# Altium project Sandbox.PrjPcb
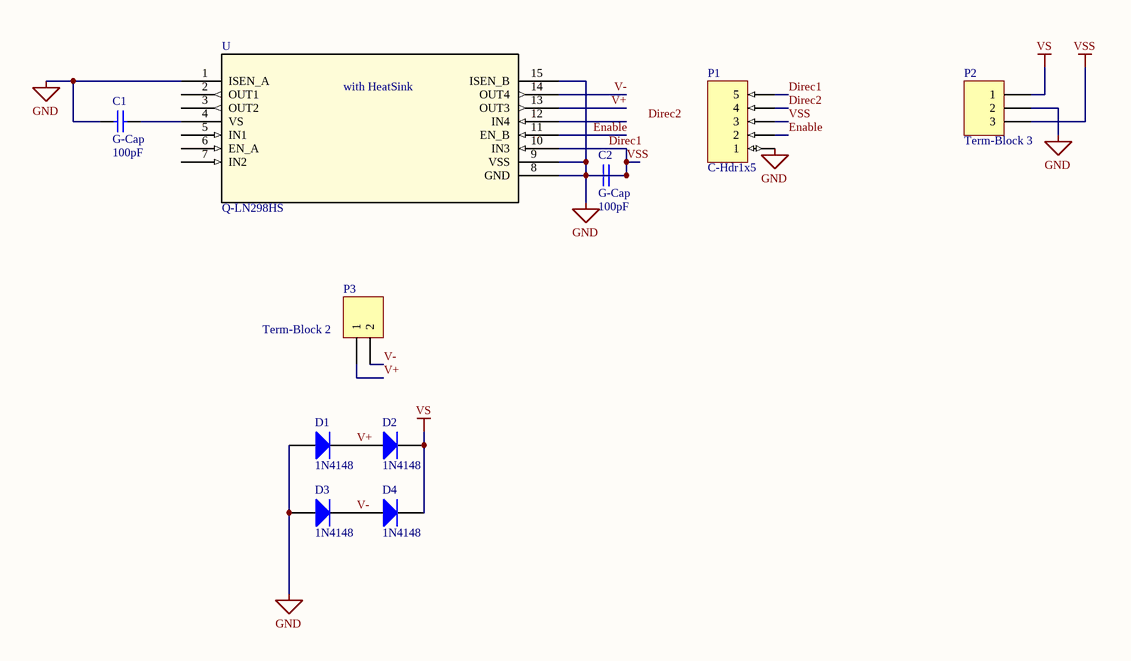
[diagram p0: Sheet1.SchDoc]
1 sheet, 10 parts. Net scope: global (net labels, ports and power ports of the same name join across sheets).
Board file: PCB1.PcbDoc

## Sheet Sheet1.SchDoc
size A4

### Parts
C1  G-Cap  value 100pF  [Cap2.54mm_LGE1.0]
C2  G-Cap  value 100pF  [Cap2.54mm_LGE1.0]
D1  1N4148  [DO-41_XLGE1.2]
D2  1N4148  [DO-41_XLGE1.2]
D3  1N4148  [DO-41_XLGE1.2]
D4  1N4148  [DO-41_XLGE1.2]
P1  C-Hdr1x5  [HDR1X5_LGE1.0]
P2  Term-Block 3  [TERM-BLOCK-5.08MM-3POS]
P3  Term-Block 2  [TERM-BLOCK-5.08MM-2POS]
U  Q-LN298HS  [Multiwatt15_V_ELEC391HS]

### Nets
Direc1: C1.1 C2.1 C2.2 D1.1(A) D3.1(A) P1.1 P1.3 P1.5 P2.2 P2.3 U.1(ISEN_A) U.8(GND) U.9(VSS) U.10(IN3) U.15(ISEN_B)  [also labelled GND, VSS]
VS: D2.2(K) D4.2(K) P2.1
Direc2: P1.4
Enable: P1.2 U.11(EN_B)
V+: D1.2(K) D2.1(A) P3.1 U.13(OUT3)
V-: D3.2(K) D4.1(A) P3.2 U.14(OUT4)
NetC1_2: C1.2 U.4(VS)

Not connected (* = marked no-connect by the designer): U 2(OUT1) 3(OUT2) 5(IN1) 6(EN_A) 7(IN2) 12(IN4)

### Notes on the sheet
- Labels drawn without touching a wire or pin: Direc2
- (in symbol Q-LN298HS) with HeatSink

### Library data of the parts
C1 C2 = G-Cap: Capacitor (specify value); Published: 8-Jun-2000; LatestRevisionDate: 17-Jul-2002; LatestRevisionNote: Re-released for DXP Platform.; PackageReference: RAD-0.3; Publisher: Altium Limited
D1-D4 = T-DiodeRect: High-speed Diode; ComponentLink1URL: http://www.mccsemi.com/up_pdf/1N4148(DO-35).pdf; ComponentLink1Description: Datasheet (ELEC391)
P1 = C-Hdr1x5: Header, 6-Pin; LatestRevisionDate: 17-Jul-2002; LatestRevisionNote: Re-released for DXP Platform.; Publisher: Altium Limited
P2 = C-Block3: Terminal-Block 1x3; LatestRevisionDate: 17-Jul-2002; LatestRevisionNote: Re-released for DXP Platform.; Publisher: Altium Limited
P3 = C-Block2: Terminal-Block 1x2; LatestRevisionDate: 17-Jul-2002; LatestRevisionNote: Re-released for DXP Platform.; Publisher: Altium Limited
U = Q-LN298HS: LN298 - IC Bridge Driver Par 15Multiwatt; Manufacturer_Part_Number: L298N; Vendor: ST Microelectronics; Input Type: Non-Inverting; Number of Outputs: 4; Current - Output / Channel: 2A; Current - Peak Output: 3A; Voltage - Supply: 4.5 V ~ 46 V; C: Copyright (C) 2015 Accelerated Designs. All rights reserved; Quantity_Available: 5651; DataSheet: http://www.st.com/internet/com/TECHNICAL_RESOURCES/TECHNICAL_LITERATURE/DATASHEET/CD00000240.pdf; Type: Type; On-State Resistance: -; Operating Temperature: -25Â°C ~ 130Â°C; Mounting Type: Through Hole; Package / Case: Multiwatt-15 (Vertical, Bent and Staggered Leads); Supplier Device Package: 15-Multiwatt; Packaging: Tube; Copyright: Copyright (C) 2015 Accelerated Designs. All rights reserved; RefDes: RefDes; Value: Value; ComponentLink1URL: http://www.st.com/content/ccc/resource/technical/document/datasheet/82/cc/3f/39/0a/29/4d/f0/CD00000240.pdf/files/CD00000240.pdf/jcr:content/translations/en.CD00000240.pdf; ComponentLink1Description: Datasheet (ELEC391)